# Altium project Prototype_2_Main_Board.PrjPcb (part 2 of 2)

## Sheet ShinStrap_Interface.SchDoc
size A3; Organization: Altium Limited; Address1: L3, 12a Rodborough Rd; Address2: Frenchs Forest; Address3: NSW; Address4: Australia 2086; DocumentNumber: 7; SheetNumber: 7; SheetTotal: 8
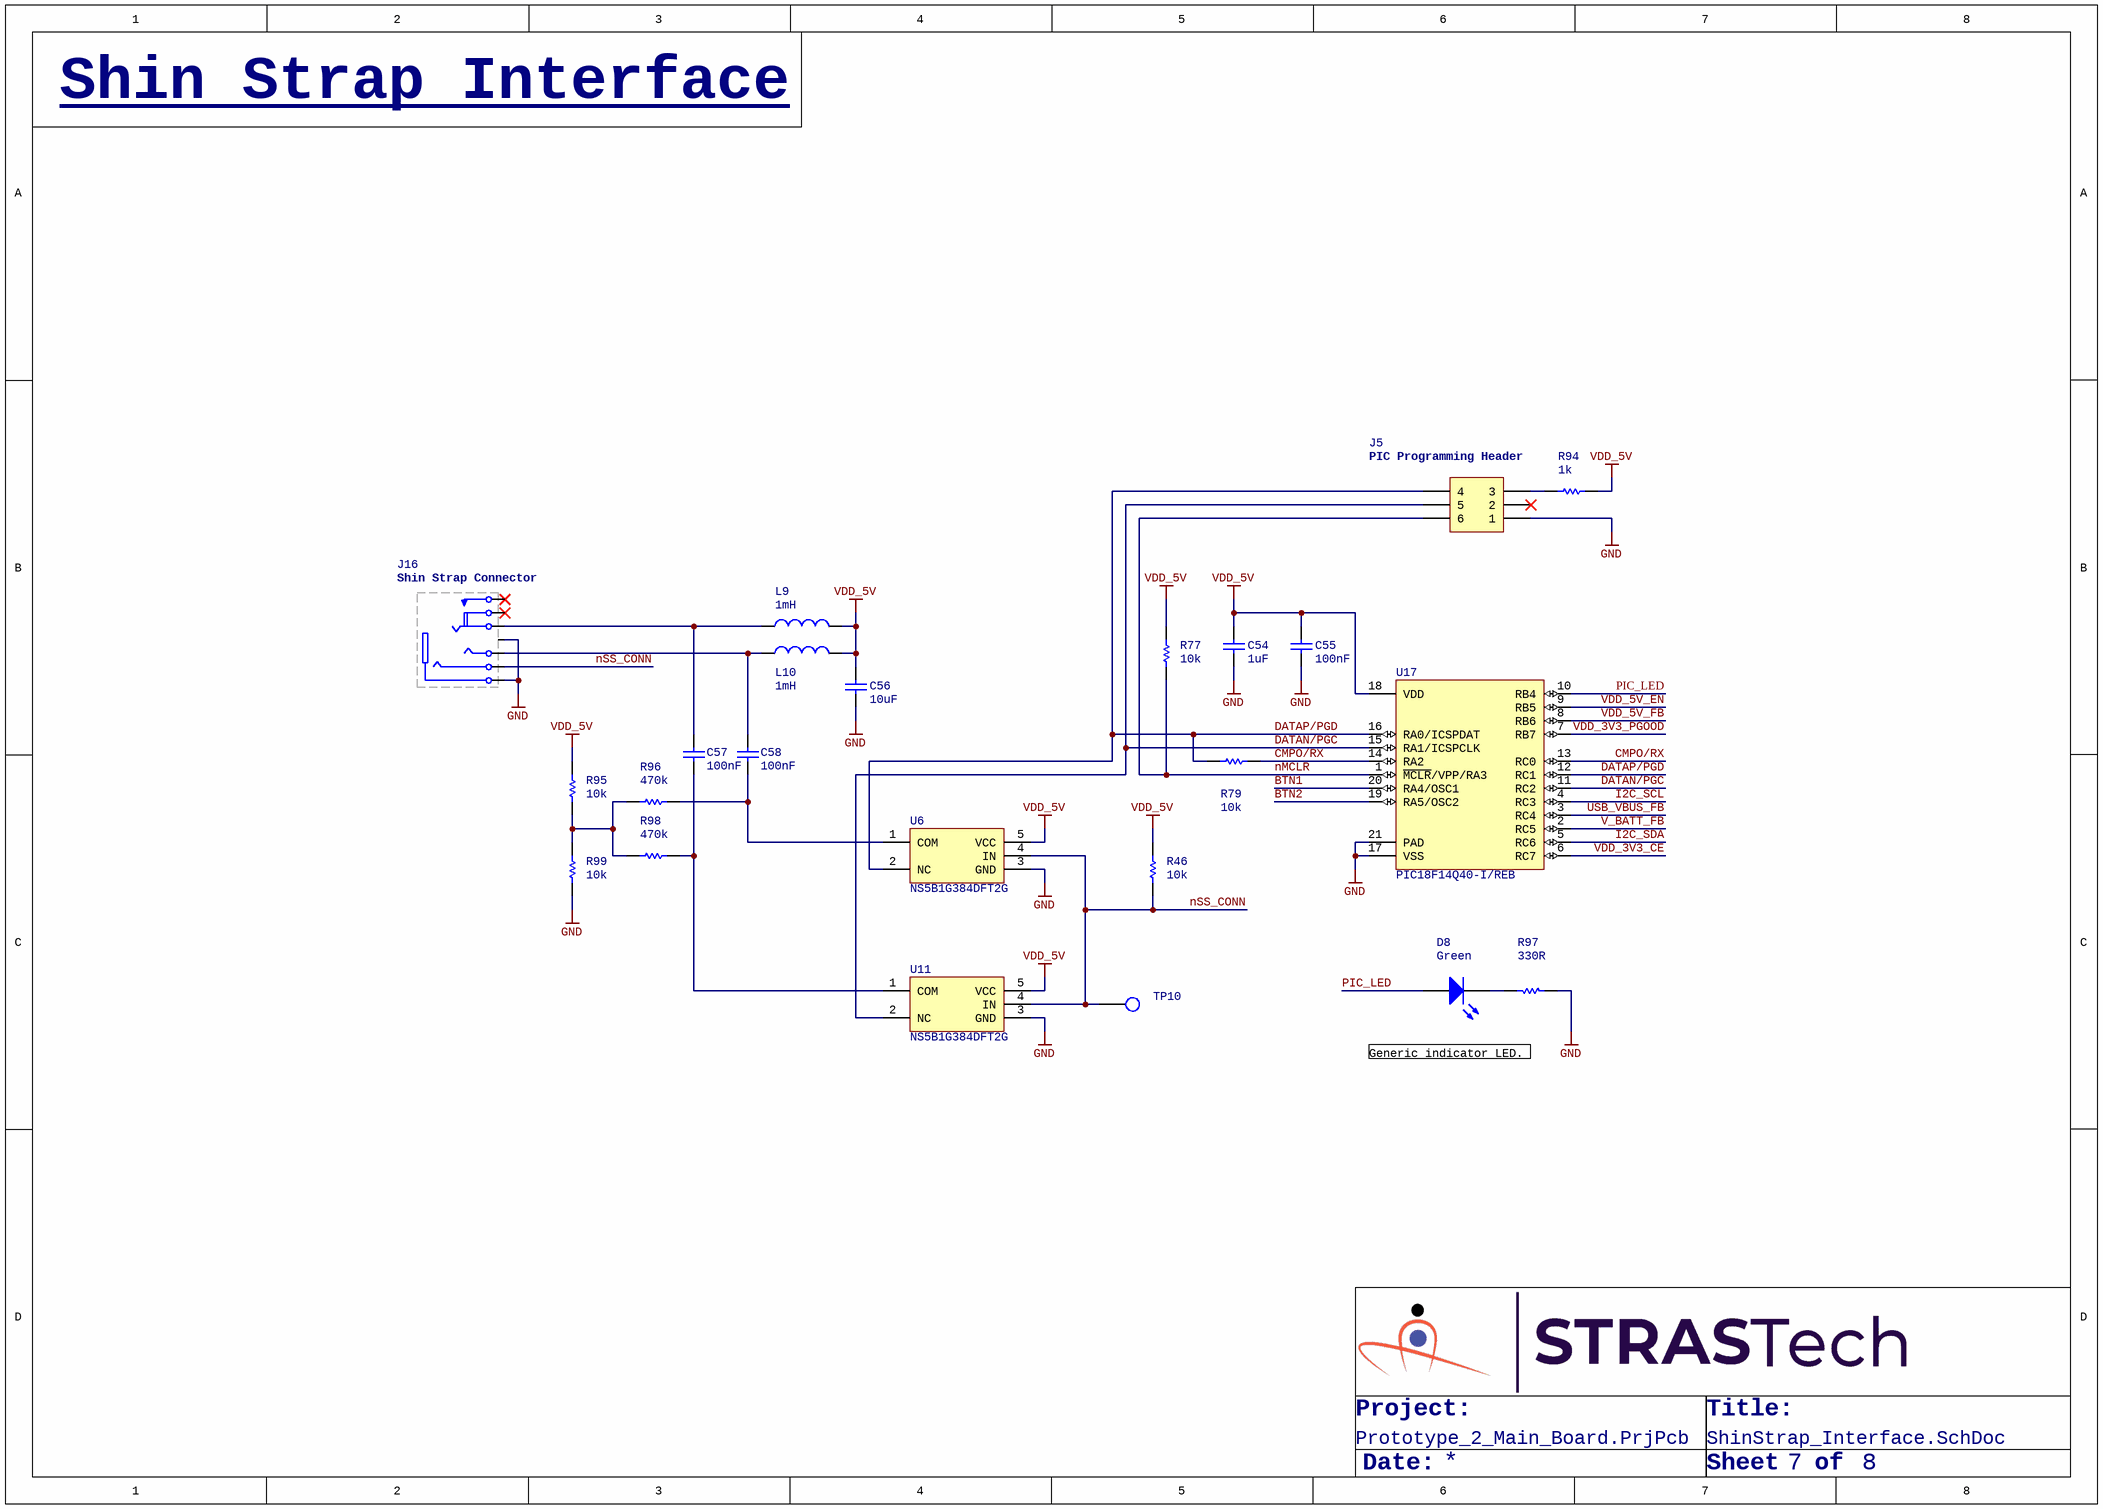
[diagram p7: ShinStrap_Interface.SchDoc]

### Parts
C54  1uF  [Cap,SMD,0402]
C55  100nF  [Cap,SMD,0402]
C56  10uF  [Cap,SMD,0402]
C57  100nF  [Cap,SMD,0402]
C58  100nF  [Cap,SMD,0402]
D8  Green  [LED,0603]
J5  Term,Header,3x2 Pin,1.27mm,SMD  [TERM,HEADER,3X2PIN,P1.27,SMD]  (value not drawn)
J16  Conn,Jack,TRS,3.5mm,Thru,Shielded  [Conn,Jack,TRS,3.5mm,Thru,Shielded]  (value not drawn)
L9  1mH  [IND,1210]
L10  1mH  [IND,1210]
R46  10k  [RES,0402]
R77  10k  [RES,0402]
R79  10k  [RES,0402]
R94  1k  [RES,0402]
R95  10k  [RES,0402]
R96  470k  [RES,0402]
R97  330R  [RES,0402]
R98  470k  [RES,0402]
R99  10k  [RES,0402]
TP10  TESTPOINT  [testpoint,smd,round,1mm]  (value not drawn)
U6  NS5B1G384DFT2G  [SC70-5]
U11  NS5B1G384DFT2G  [SC70-5]
U17  PIC18F14Q40-I/REB  [IC,QFN-20,3x3,PAD,P0.4]

### Nets
GND: C54.1 C55.1 C56.1 J5.1 J16.0(SH) J16.1(S) R97.1 R99.1 U6.3(GND) U11.3(GND) U17.17(VSS) U17.21(PAD)
VDD_5V: C54.2 C55.2 C56.2 L9.2 L10.2 R46.2 R77.2 R94.2 R95.2 U6.5(VCC) U11.5(VCC) U17.18(VDD)
BTN1: U17.20(RA4/OSC1)
BTN2: U17.19(RA5/OSC2)
CMPO/RX: R79.1 U17.13(RC0) U17.14(RA2)
DATAN/PGC: J5.5 U11.2(NC) U17.11(RC2) U17.15(RA1/ICSPCLK)
DATAP/PGD: J5.4 R79.2 U6.2(NC) U17.12(RC1) U17.16(RA0/ICSPDAT)
I2C_SCL: U17.4(RC3)
I2C_SDA: U17.5(RC6)
nMCLR: J5.6 R77.1 U17.1(~{MCLR}/VPP/RA3)
nSS_CONN: J16.4(R2) R46.1 TP10.1(TP) U6.4(IN) U11.4(IN)
PIC_LED: D8.1(A) U17.10(RB4)
USB_VBUS_FB: U17.3(RC4)
V_BATT_FB: U17.2(RC5)
VDD_3V3_CE: U17.6(RC7)
VDD_3V3_PGOOD: U17.7(RB7)
VDD_5V_EN: U17.9(RB5)
VDD_5V_FB: U17.8(RB6)
NetC57_1: C57.1 R98.1 U11.1(COM)
NetC57_2: C57.2 J16.3(R1) L9.1
NetC58_1: C58.1 R96.1 U6.1(COM)
NetC58_2: C58.2 J16.2(T) L10.1
NetD8_2: D8.2(K) R97.2
NetJ5_3: J5.3 R94.1
NetR95_1: R95.1 R96.2 R98.2 R99.2

Not connected (* = marked no-connect by the designer): J5 2*; J16 5(IR1)* 6(R1S)*

### Notes on the sheet
- Shin Strap Interface
- (near J5) PIC Programming Header
- (near J16) Shin Strap Connector
- Generic indicator LED.
- Project:
- Title:
- Date:
- Sheet
- of
- Title
- Size:
- A3
- Revision:
- Design By:

### Library data of the parts
C54 = CAP,Cer,1uF,35VDC,X5R,0402: 1 µF ±10% 35V Ceramic Capacitor X5R 0402 (1005 Metric); Vendor Part Number: 445-9073-1-ND; Manufacturer: TDK Corporation; Manufacturer Part Number: C1005X5R1V105K050BC; Vendor: Digikey; HelpURL: https://product.tdk.com/info/en/catalog/datasheets/mlcc_commercial_general_en.pdf?ref_disty=digikey; CreatedBy: Judd Foster
C55 C57 C58 = CAP,Cer,100nF,25VDC,X7R,0402: 0.1µF ±10% 25V Ceramic Capacitor X7R 0402 (1005 Metric); Vendor Part Number: 490-14603-1-ND; Manufacturer: Murata Electronics; Manufacturer Part Number: GRM155R71E104KE14J; Vendor: Digikey; HelpURL: https://search.murata.co.jp/Ceramy/image/img/A01X/G101/ENG/GRM155R71E104KE14-01.pdf; CreatedBy: Judd Foster
C56 = CAP,Cer,10uF,10VDC,X5R,0402: 10 µF ±20% 10V Ceramic Capacitor X5R 0402 (1005 Metric); Vendor Part Number: 1276-1450-1-ND; Manufacturer: Samsung Electro-Mechanics; Manufacturer Part Number: CL05A106MP5NUNC; Vendor: Digikey; HelpURL: https://media.digikey.com/pdf/Data%20Sheets/Samsung%20PDFs/CL05A106MP5NUNC_Spec.pdf; CreatedBy: Judd Foster
D8 = LED,Green,SMD,0603: Green 530nm LED Indication - Discrete 3V 0603 (1608 Metric); Manufacturer: Stanley Electric Co; Manufacturer Part Number: THG1111C-0005-TR; Vendor Part Number: 404-1286-1-ND; Vendor: Digikey; CreatedBy: Judd Foster; HelpURL: http://www.stanley-components.com/php/downloaddatafile.php?rp=0,THG1111C-0005_e.pdf
J5 = Term,Header,3x2 Pin,1.27mm,SMD: Connector Header Surface Mount 6 position 0.050" (1.27mm); Vendor Part Number: 609-3693-1-ND; Manufacturer: Amphenol ICC (FCI); Manufacturer Part Number: 20021121-00006C4LF; Vendor: Digikey; HelpURL: https://media.digikey.com/pdf/Data%20Sheets/FCI%20PDFs/Minitek%20127_Catalog.pdf; CreatedBy: Judd Foster
J16 = Conn,Jack,TRS,3.5mm,Thru,Shielded: 3.50mm (0.141", 1/8", Mini Plug) - Headphone Phone Jack Stereo (4 Conductor, TRRS) Connector Solder; Manufacturer: CUI Devices; Manufacturer Part Number: SJ-435107RS; Vendor Part Number: CP-435107RS-ND; Vendor: Digikey; CreatedBy: Judd Foster; HelpURL: https://www.cuidevices.com/product/resource/digikeypdf/sj-435107.pdf
L9 L10 = IND,1mH,100mA,Wirewound,1210: 1 mH Unshielded Wirewound Inductor 100 mA 16.9Ohm Max 1210 (3225 Metric); Vendor Part Number: 587-CBC3225T102MRCT-ND; Manufacturer: Taiyo Yuden; Manufacturer Part Number: CBC3225T102MR; Vendor: Digikey; HelpURL: https://ds.yuden.co.jp/TYCOMPAS/ut/detail?pn=CBC3225T102MR%20&u=M; CreatedBy: Judd Foster
R46 R77 R79 R95 R99 = RES,10k,5%,0.063W,0402: 10 kOhms ±5% 0.063W, 1/16W Chip Resistor 0402 (1005 Metric) Automotive AEC-Q200 Thick Film; Vendor Part Number: RMCF0402JT10K0CT-ND; Manufacturer: Stackpole Electronics Inc; Manufacturer Part Number: RMCF0402JT10K0; Vendor: DIgikey; HelpURL: https://www.seielect.com/catalog/sei-rmcf_rmcp.pdf; CreatedBy: Judd Foster
R94 = RES,1k,5%,0.063W,0402: 1 kOhms ±5% 0.063W, 1/16W Chip Resistor 0402 (1005 Metric) Automotive AEC-Q200 Thick Film; Vendor Part Number: RMCF0402JT1K00CT-ND; Manufacturer: Stackpole Electronics Inc; Manufacturer Part Number: RMCF0402JT1K00; Vendor: DIgikey; HelpURL: https://www.seielect.com/catalog/sei-rmcf_rmcp.pdf; CreatedBy: Judd Foster
R96 R98 = RES,470k,5%,0.063W,0402: 470 kOhms ±5% 0.063W, 1/16W Chip Resistor 0402 (1005 Metric) Automotive AEC-Q200 Thick Film; Manufacturer: Stackpole Electronics Inc; Manufacturer Part Number: RMCF0402JT470K; Vendor Part Number: RMCF0402JT470KCT-ND; Vendor: Digikey; CreatedBy: Judd Foster; HelpURL: https://www.seielect.com/catalog/sei-rmcf_rmcp.pdf
R97 = RES,330R,5%,0.063W,0402: 330 Ohms ±5% 0.063W, 1/16W Chip Resistor 0402 (1005 Metric) Automotive AEC-Q200 Thick Film; Manufacturer: Stackpole Electronics Inc; Manufacturer Part Number: RMCF0402JT330R; Vendor Part Number: RMCF0402JT330RCT-ND; Vendor: Digikey; CreatedBy: Judd Foster; HelpURL: https://www.seielect.com/catalog/sei-rmcf_rmcp.pdf
TP10 = TESTPOINT: PCB Testpoint; CreatedBy: Judd Foster; HelpURL: N/A; Manufacturer: N/A; Manufacturer Part Number: N/A; Vendor: N/A; Vendor Part Number: N/A
U6 U11 = NS5B1G384DFT2G: 1 Circuit IC Switch 1:1 15Ohm SC-88A (SC-70-5/SOT-353); Manufacturer: onsemi; Vendor Part Number: NS5B1G384DFT2GOSCT-ND; Vendor: Digikey; CreatedBy: Judd Foster; HelpURL: https://www.onsemi.com/pdf/datasheet/ns5b1g384-d.pdf; Manufacturer Part Number: NS5B1G384DFT2G
U17 = PIC18F14Q40-I/REB: PIC series Microcontroller IC 8-Bit 64MHz 16KB (16K x 8) FLASH 20-VQFN (3x3); Manufacturer: Microchip Technology; Vendor Part Number: 150-PIC18F14Q40-I/REB-ND; Vendor: Digikey; CreatedBy: Judd Foster; HelpURL: https://ww1.microchip.com/downloads/en/DeviceDoc/PIC18F04-05-14-15-Q40-1420-Pin-Low-Power-High-Performance-Microcontroller-With-XLP-Technology-Data-Sheet-40002236B.pdf; Manufacturer Part Number: PIC18F14Q40-I/REB

## Nets that join several sheets
A_GND: Load_Cell_Biasing (10 pins), Load_Cell_Acquisition (16 pins), Regulation_Charging (C47.2)
GND: Processor (27 pins), USB_Serial (12 pins), Load_Cell_Biasing (R60.1 R61.1), Load_Cell_Acquisition (C32.1 C62.2 NT1.1 U7.19), Inertial_Measurement_RTC (16 pins), Peripherals_Main_Board (9 pins), Regulation_Charging (33 pins), ShinStrap_Interface (12 pins)
USB_VBUS: USB_Serial (5 pins), Regulation_Charging (8 pins)
VDD_3V3: Processor (22 pins), Load_Cell_Acquisition (L4.2 R39.2 R40.2), Inertial_Measurement_RTC (14 pins), Peripherals_Main_Board (9 pins), Regulation_Charging (6 pins)
VDD_5V: Peripherals_Main_Board (J3.1 J3.2 J3.3), Regulation_Charging (12 pins), ShinStrap_Interface (12 pins)
VDD_5VA: Load_Cell_Biasing (6 pins), Load_Cell_Acquisition (R31.2 R44.2), Regulation_Charging (C47.1 R87.2 TP21.1)
BTN1: Peripherals_Main_Board (J3.24), ShinStrap_Interface (U17.20)
BTN2: Peripherals_Main_Board (J3.23), ShinStrap_Interface (U17.19)
DETECT_1: Processor (U1.43), Load_Cell_Biasing (R60.2 R67.1)
DETECT_2: Processor (U1.45), Load_Cell_Biasing (R61.2 R68.1)
ESP32_CHIP_PU: Processor (5 pins), USB_Serial (Q1.3)
ESP32_GPIO0: Processor (R3.2 SW1.1 SW1.2 U1.5), USB_Serial (Q2.3), Peripherals_Main_Board (J3.22)
ESP32_UART_RXD: Processor (R1.1 U1.50), USB_Serial (R12.2)
ESP32_UART_TXD: Processor (R2.2), USB_Serial (R11.2)
I2C_SCL: Processor (U1.40), Inertial_Measurement_RTC (R57.1 U8.A2 U9.13 U10.7), Peripherals_Main_Board (J3.19), ShinStrap_Interface (U17.4)
I2C_SDA: Processor (U1.41), Inertial_Measurement_RTC (R58.1 U8.B2 U9.14 U10.6), Peripherals_Main_Board (J3.20), ShinStrap_Interface (U17.5)
LCD_CSX: Processor (U1.10), Peripherals_Main_Board (J3.17)
LCD_D_CX: Processor (U1.8), Peripherals_Main_Board (J3.16)
LCD_SDI: Processor (U1.7), Peripherals_Main_Board (J3.13)
LCD_SDO: Processor (U1.6), Peripherals_Main_Board (J3.11)
LCD_WRX: Processor (U1.9), Peripherals_Main_Board (J3.15)
LOAD_CELL_1: Load_Cell_Biasing (J2.8), Load_Cell_Acquisition (R33.2)
LOAD_CELL_2: Load_Cell_Biasing (J2.7), Load_Cell_Acquisition (R34.2)
LOAD_CELL_3: Load_Cell_Biasing (J2.6), Load_Cell_Acquisition (R48.2)
LOAD_CELL_4: Load_Cell_Biasing (J2.5), Load_Cell_Acquisition (R50.2)
LOAD_CELL_BIAS_12: Load_Cell_Biasing (C25.2 R18.1 U5.15), Load_Cell_Acquisition (R35.1)
LOAD_CELL_BIAS_34: Load_Cell_Biasing (C28.2 R28.1 U5.5), Load_Cell_Acquisition (R51.1)
MCP3561_nCS: Processor (U1.12), Load_Cell_Acquisition (R41.1)
nCHG_EN: Processor (U1.23), Regulation_Charging (R69.2 U12.6)
nCHG_OK: Processor (U1.44), Regulation_Charging (R83.2 U12.11)
nLCD_RESET: Processor (U1.25), Peripherals_Main_Board (J3.9)
PCM1780_BCK: Processor (U1.24), Load_Cell_Biasing (R26.1)
PCM1780_DATA: Processor (U1.13), Load_Cell_Biasing (R25.1)
PCM1780_LRCK: Processor (U1.27), Load_Cell_Biasing (R27.1)
PCM1780_MC: Processor (U1.38), Load_Cell_Biasing (R20.1)
PCM1780_MD: Processor (U1.37), Load_Cell_Biasing (R21.1)
PCM1780_nMS: Processor (U1.39), Load_Cell_Biasing (R19.1)
PCM1780_SCK: Processor (U1.36), Load_Cell_Biasing (R24.1)
SD_CD: Processor (U1.17), Peripherals_Main_Board (J4.9 R72.1)
SD_CS: Processor (U1.15), Peripherals_Main_Board (J4.2 R64.1)
SPI_SCK: Processor (U1.18), Load_Cell_Acquisition (R42.1), Peripherals_Main_Board (J4.5 R66.1)
SPI_SDI: Processor (U1.19), Load_Cell_Acquisition (R43.1), Peripherals_Main_Board (J4.7 R62.1)
SPI_SDO: Processor (U1.16), Load_Cell_Acquisition (R45.1), Peripherals_Main_Board (J4.3 R65.1)
USB_VBUS_FB: Regulation_Charging (R75.1 R82.2 TP16.1), ShinStrap_Interface (U17.3)
V_BATT_FB: Regulation_Charging (R73.1 R74.2 TP12.1), ShinStrap_Interface (U17.2)
VDD_3V3_CE: Regulation_Charging (R90.2 TP18.1 U14.4), ShinStrap_Interface (U17.6)
VDD_3V3_PGOOD: Regulation_Charging (R88.1 TP17.1 U14.3), ShinStrap_Interface (U17.7)
VDD_5V_EN: Regulation_Charging (R85.2 TP14.1 U13.2), ShinStrap_Interface (U17.9)
VDD_5V_FB: Regulation_Charging (R78.1 R86.2 TP15.1 U13.4), ShinStrap_Interface (U17.8)
VDD_5VA_EN: Processor (U1.42), Regulation_Charging (R49.2)